# EAGLE design op (EAGLE 8.2.2)
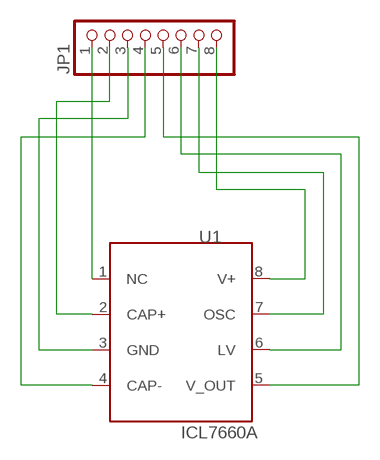
[diagram p0: schematic, sheet 1]

## Parts
JP1  PINHD-1X8/90  [1X08/90]
U1  ICL7660A  [SO08]

## Nets
N$1: JP1.1 U1.1(NC)
N$2: JP1.2 U1.2(CAP+)
N$3: JP1.3 U1.3(GND)
N$4: JP1.4 U1.4(CAP-)
N$5: JP1.5 U1.5(V_OUT)
N$6: JP1.6 U1.6(LV)
N$7: JP1.7 U1.7(OSC)
N$8: JP1.8 U1.8(V+)

## Library data of the parts
JP1 = pinhead:PINHD-1X8: PIN HEADER
U1 = usb:ICL7660A

## Board
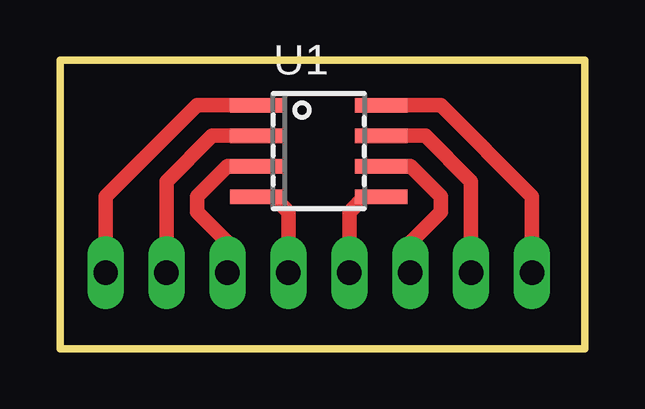
[diagram p1: board, top side]
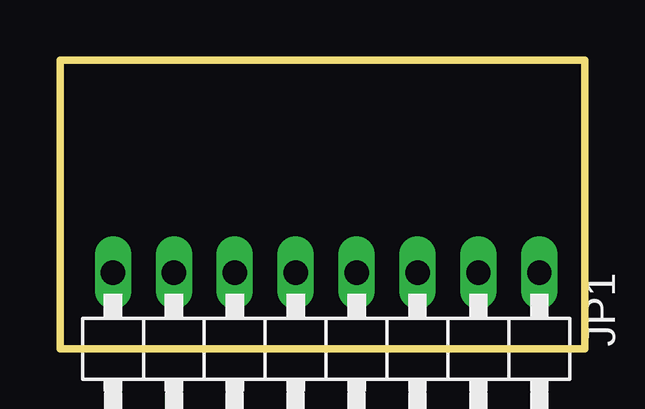
[diagram p2: board, bottom side, seen from below]

Size 21.89 x 12.05 mm. Coordinates in mm from the lower left corner, seen from the top.
Outline: 0,0 21.89,0 21.89,12.05 0,12.05 0,0
Copper layers (1*16): Top 0.035mm / dielectric 1.5mm / Bottom 0.035mm
Design rules "default": minimum track width 6mil, minimum drill 0.35mm, track to track 6mil, track to pad 6mil, pad to pad 6mil, via to via 6mil, smd to smd 6mil, copper to edge 40mil, drill to drill 6mil, minimum pad ring 10mil, minimum via ring 8mil, stop-mask expansion 4mil, vias tented up to drill 0mil, thermal gap 10mil

### Footprints (pad centres in the part's own frame; a part is rotated, then mirrored left to right if it is on the bottom)
1X08/90 = drill 1.016 long: 1 -8.89,-3.81; 2 -6.35,-3.81; 3 -3.81,-3.81; 4 -1.27,-3.81; 5 1.27,-3.81; 6 3.81,-3.81; 7 6.35,-3.81; 8 8.89,-3.81
SO08 = smd 0.6 x 2.2: 1 -1.905,-2.6; 2 -0.635,-2.6; 3 0.635,-2.6; 4 1.905,-2.6; 5 1.905,2.6; 6 0.635,2.6; 7 -0.635,2.6; 8 -1.905,2.6

### Placement (x,y rotation side)
JP1  10.79,-0.64 180 bottom
U1  10.79,8.26 270 top

### Tracks (layer width: path | path; a pad name or v marks a point on that pad's centre or on a via)
N$1
  Top 0.61: U1.1 5.71,10.16 1.91,6.35 JP1.1
N$2
  Top 0.61: U1.2 6.35,8.89 4.45,6.99 JP1.2
N$3
  Top 0.61: U1.3 6.99,7.62 5.71,6.35 5.71,5.71 6.99,4.45 JP1.3
N$4
  Top 0.61: U1.4 8.89,6.35 9.53,5.71 JP1.4
N$5
  Top 0.61: U1.5 12.7,6.35 12.06,5.71 JP1.5
N$6
  Top 0.61: U1.6 14.61,7.62 15.88,6.35 15.88,5.71 14.61,4.45 JP1.6
N$7
  Top 0.61: U1.7 15.24,8.89 17.14,6.99 JP1.7
N$8
  Top 0.61: U1.8 15.88,10.16 19.68,6.35 JP1.8